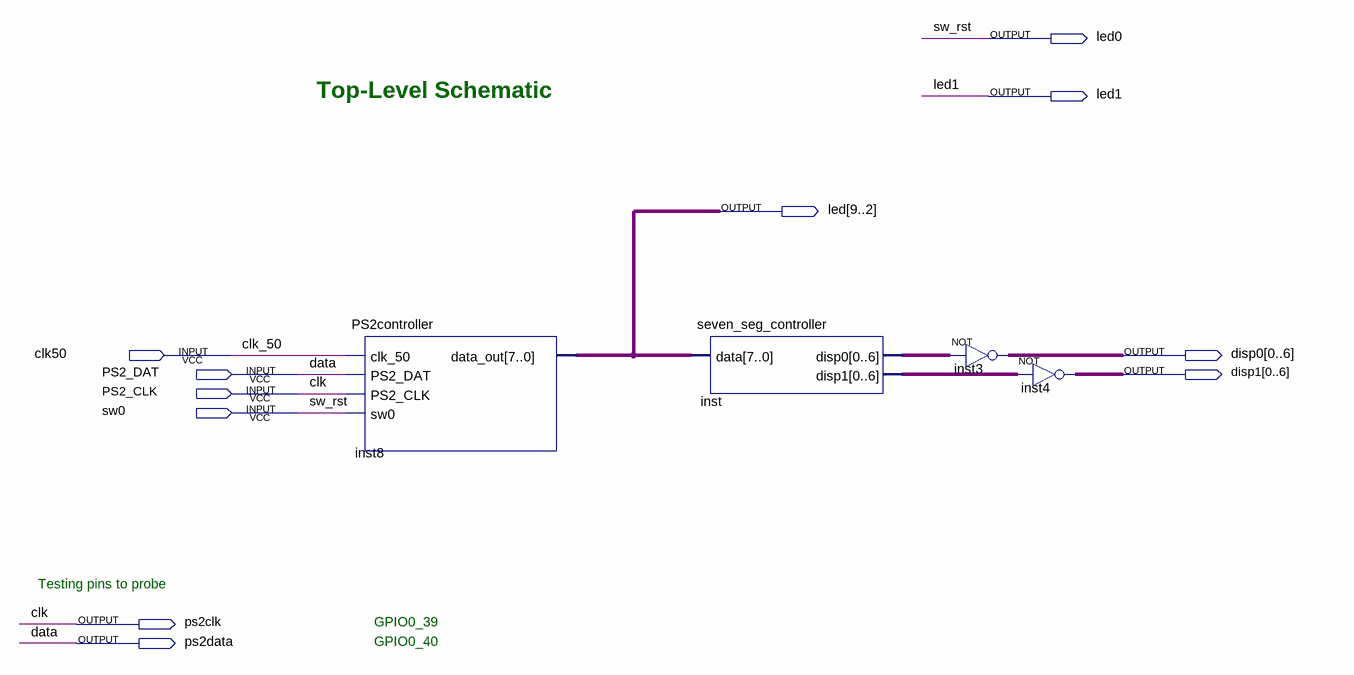
[diagram p0: schematic sheet]
// Quartus schematic TopLevel.bdf as structural Verilog: 4 symbols, 11 pins
module TopLevel (
  input  clk50,
  input  PS2_DAT,
  input  PS2_CLK,
  input  sw0,
  output led0,
  output led1,
  output [9:2] led,
  output [0:6] disp0,
  output [0:6] disp1,
  output ps2clk,
  output ps2data
);

  wire [6:0] inst_disp0, inst_disp1;

  PS2controller inst8 (.clk_50(clk50), .PS2_DAT(PS2_DAT), .PS2_CLK(PS2_CLK), .sw0(sw0), .data_out(led));
  seven_seg_controller inst (.data(led), .disp0(inst_disp0), .disp1(inst_disp1));
  assign disp0 = ~inst_disp0;  // NOT inst3, 7 bits wide
  assign disp1 = ~inst_disp1;  // NOT inst4, 7 bits wide

  assign led0 = sw0;
  assign ps2clk = PS2_CLK;
  assign ps2data = PS2_DAT;

  // Other names for the same wires on the sheet: clk = PS2_CLK; clk_50 = clk50; data = PS2_DAT; sw_rst = sw0

  // Notes on the sheet:
  //   Top-Level Schematic
  //   Testing pins to probe
  //   GPIO0_39
  //   GPIO0_40
endmodule
